# Altium schematic sheet Power.SchDoc
size A
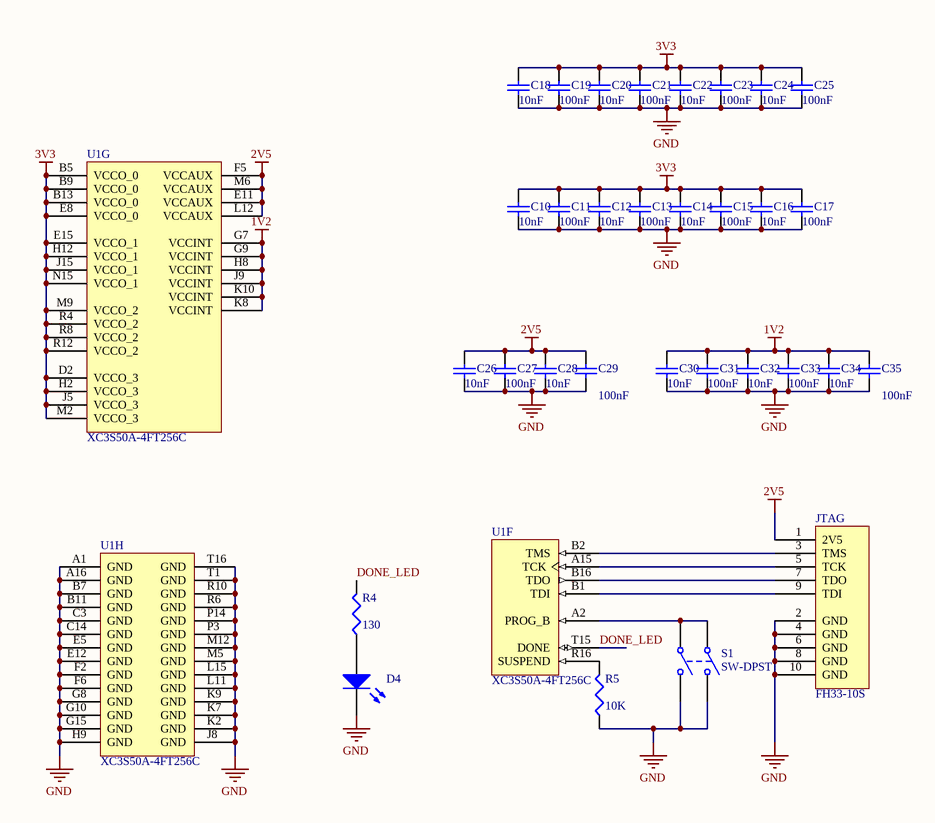
[diagram p0: Power.SchDoc]

## Parts
C10  value 10nF  [0402]  (hidden comment: Cap Semi)
C11  value 100nF  [0402]  (hidden comment: Cap Semi)
C12  value 10nF  [0402]  (hidden comment: Cap Semi)
C13  value 100nF  [0402]  (hidden comment: Cap Semi)
C14  value 10nF  [0402]  (hidden comment: Cap Semi)
C15  value 100nF  [0402]  (hidden comment: Cap Semi)
C16  value 10nF  [0402]  (hidden comment: Cap Semi)
C17  value 100nF  [0402]  (hidden comment: Cap Semi)
C18  value 10nF  [0402]  (hidden comment: Cap Semi)
C19  value 100nF  [0402]  (hidden comment: Cap Semi)
C20  value 10nF  [0402]  (hidden comment: Cap Semi)
C21  value 100nF  [0402]  (hidden comment: Cap Semi)
C22  value 10nF  [0402]  (hidden comment: Cap Semi)
C23  value 100nF  [0402]  (hidden comment: Cap Semi)
C24  value 10nF  [0402]  (hidden comment: Cap Semi)
C25  value 100nF  [0402]  (hidden comment: Cap Semi)
C26  value 10nF  [0402]  (hidden comment: Cap Semi)
C27  value 100nF  [0402]  (hidden comment: Cap Semi)
C28  value 10nF  [0402]  (hidden comment: Cap Semi)
C29  value 100nF  [0402]  (hidden comment: Cap Semi)
C30  value 10nF  [0402]  (hidden comment: Cap Semi)
C31  value 100nF  [0402]  (hidden comment: Cap Semi)
C32  value 10nF  [0402]  (hidden comment: Cap Semi)
C33  value 100nF  [0402]  (hidden comment: Cap Semi)
C34  value 10nF  [0402]  (hidden comment: Cap Semi)
C35  value 100nF  [0402]  (hidden comment: Cap Semi)
D4  LED3  [1608[0603]]  (value not drawn)
JTAG  FH33-10S  [PCBComponent_1 - duplicate]
R4  value 130  [J1-0603]  (hidden comment: Res3)
R5  value 10K  [J1-0603]  (hidden comment: Res3)
S1  SW-DPST  [DPST-4]
U1  XC3S50A-4FT256C  [FT256]  (parts F,G,H of 9)

## Nets
1V2: C30.1 C31.1 C32.1 C33.1 C34.1 C35.1 U1.G7(VCCINT) U1.G9(VCCINT) U1.H8(VCCINT) U1.J9(VCCINT) U1.K8(VCCINT) U1.K10(VCCINT)
2V5: C26.1 C27.1 C28.1 C29.1 JTAG.1(2V5) U1.E11(VCCAUX) U1.F5(VCCAUX) U1.L12(VCCAUX) U1.M6(VCCAUX)
3V3: C10.1 C11.1 C12.1 C13.1 C14.1 C15.1 C16.1 C17.1 C18.1 C19.1 C20.1 C21.1 C22.1 C23.1 C24.1 C25.1 U1.B5(VCCO_0) U1.B9(VCCO_0) U1.B13(VCCO_0) U1.D2(VCCO_3) U1.E8(VCCO_0) U1.E15(VCCO_1) U1.H2(VCCO_3) U1.H12(VCCO_1) U1.J5(VCCO_3) U1.J15(VCCO_1) U1.M2(VCCO_3) U1.M9(VCCO_2) U1.N15(VCCO_1) U1.R4(VCCO_2) U1.R8(VCCO_2) U1.R12(VCCO_2)
GND: C10.2 C11.2 C12.2 C13.2 C14.2 C15.2 C16.2 C17.2 C18.2 C19.2 C20.2 C21.2 C22.2 C23.2 C24.2 C25.2 C26.2 C27.2 C28.2 C29.2 C30.2 C31.2 C32.2 C33.2 C34.2 C35.2 D4.2(K) JTAG.2(GND) JTAG.4(GND) JTAG.6(GND) JTAG.8(GND) JTAG.10(GND) R5.1 S1.2(NO1) S1.4(NO2) U1.A1(GND) U1.A16(GND) U1.B7(GND) U1.B11(GND) U1.C3(GND) U1.C14(GND) U1.E5(GND) U1.E12(GND) U1.F2(GND) U1.F6(GND) U1.G8(GND) U1.G10(GND) U1.G15(GND) U1.H9(GND) U1.J8(GND) U1.K2(GND) U1.K7(GND) U1.K9(GND) U1.L11(GND) U1.L15(GND) U1.M5(GND) U1.M12(GND) U1.P3(GND) U1.P14(GND) U1.R6(GND) U1.R10(GND) U1.T1(GND) U1.T16(GND)
DONE_LED: R4.2 U1.T15(DONE)
NetD4_1: D4.1(A) R4.1
NetJTAG_3: JTAG.3(TMS) U1.B2(TMS)
NetJTAG_5: JTAG.5(TCK) U1.A15(TCK)
NetJTAG_7: JTAG.7(TDO) U1.B16(TDO)
NetJTAG_9: JTAG.9(TDI) U1.B1(TDI)
NetR5_2: R5.2 U1.R16(SUSPEND)
NetS1_1: S1.1(COMMON1) S1.3(COMMON2) U1.A2(PROG_B)

## Library data of the parts
C10-C35 = Cap Semi: Capacitor (Semiconductor SIM Model); Published: 8-Jun-2000; LatestRevisionDate: 29-May-2009; LatestRevisionNote: IPC-7351 Footprint Added.; PackageReference: C1206; Publisher: Altium Limited; PackageDescription: Chip Capacitor
D4 = LED3: Typical BLUE SiC LED; Published: 8-Jun-2000; LatestRevisionDate: 17-Dec-2003; LatestRevisionNote: PCB Footprint replaced.; DatasheetVersion: 16-Apr-2002; PackageVersion: 16-Apr-2002; PackageReference: 3.5X2.8X1.9; Publisher: Altium Limited; PackageDescription: SM LED; 2 C-Bend Leads; Body 3.5 x 2.8 x 1.9 mm, inc leads (LxWxH typ)
JTAG = Component_1
R4 R5 = Res3: Resistor; Published: 8-Jun-2000; LatestRevisionDate: 29-May-2009; LatestRevisionNote: IPC-7351 Footprint Added.; PackageReference: J1-0603; Publisher: Altium Limited; PackageDescription: Chip Resistor
S1 = SW-DPST: Double-Pole, Single-Throw Switch; Published: 24-Mar-1999; LatestRevisionDate: 17-Jul-2002; LatestRevisionNote: Re-released for DXP Platform.; PackageReference: DPST-4; Publisher: Altium Limited; PackageDescription: Switch; 4 Leads
U1 = XC3S50A-4FT256C: Spartan-3A I/O Optimized FPGA, 144 User I/Os, 256-Ball FTBGA, Standard Performance, Commercial Grade; Published: 12-Dec-2006; LatestRevisionDate: 24-Apr-2009; LatestRevisionNote: Updated to datasheet version 1.8 Mar-2009; DatasheetVersion: ver1.8, Mar-2009; PackageVersion: ver1.3, Oct-2007; PackageReference: FT256; Publisher: Altium Limited; PackageDescription: 256-Ball Fine Pitch Thin Ball Grid Array 1.00 mm Pitch (FT256); Supplier 1: Digi-Key; Supplier Part Number 1: XC3S50A-4FT256C-ND; Code_JEDEC: MS-034-AAF-1*; ComponentLink1Description: Spartan-3A Datasheet; ComponentLink1URL: http://www.xilinx.com/support/documentation/data_sheets/ds529.pdf; ComponentLink2Description: FT256 Package Drawing; ComponentLink2URL: http://www.xilinx.com/support/documentation/package_specs/ft256.pdf; ComponentLink3Description: Spartan-3A Documents; ComponentLink3URL: http://www.xilinx.com/support/documentation/spartan-3a.htm; ComponentLink4Description: Xilinx.com Home; ComponentLink4URL: http://www.xilinx.com